# Altium project PADS_PCB.PrjPcb
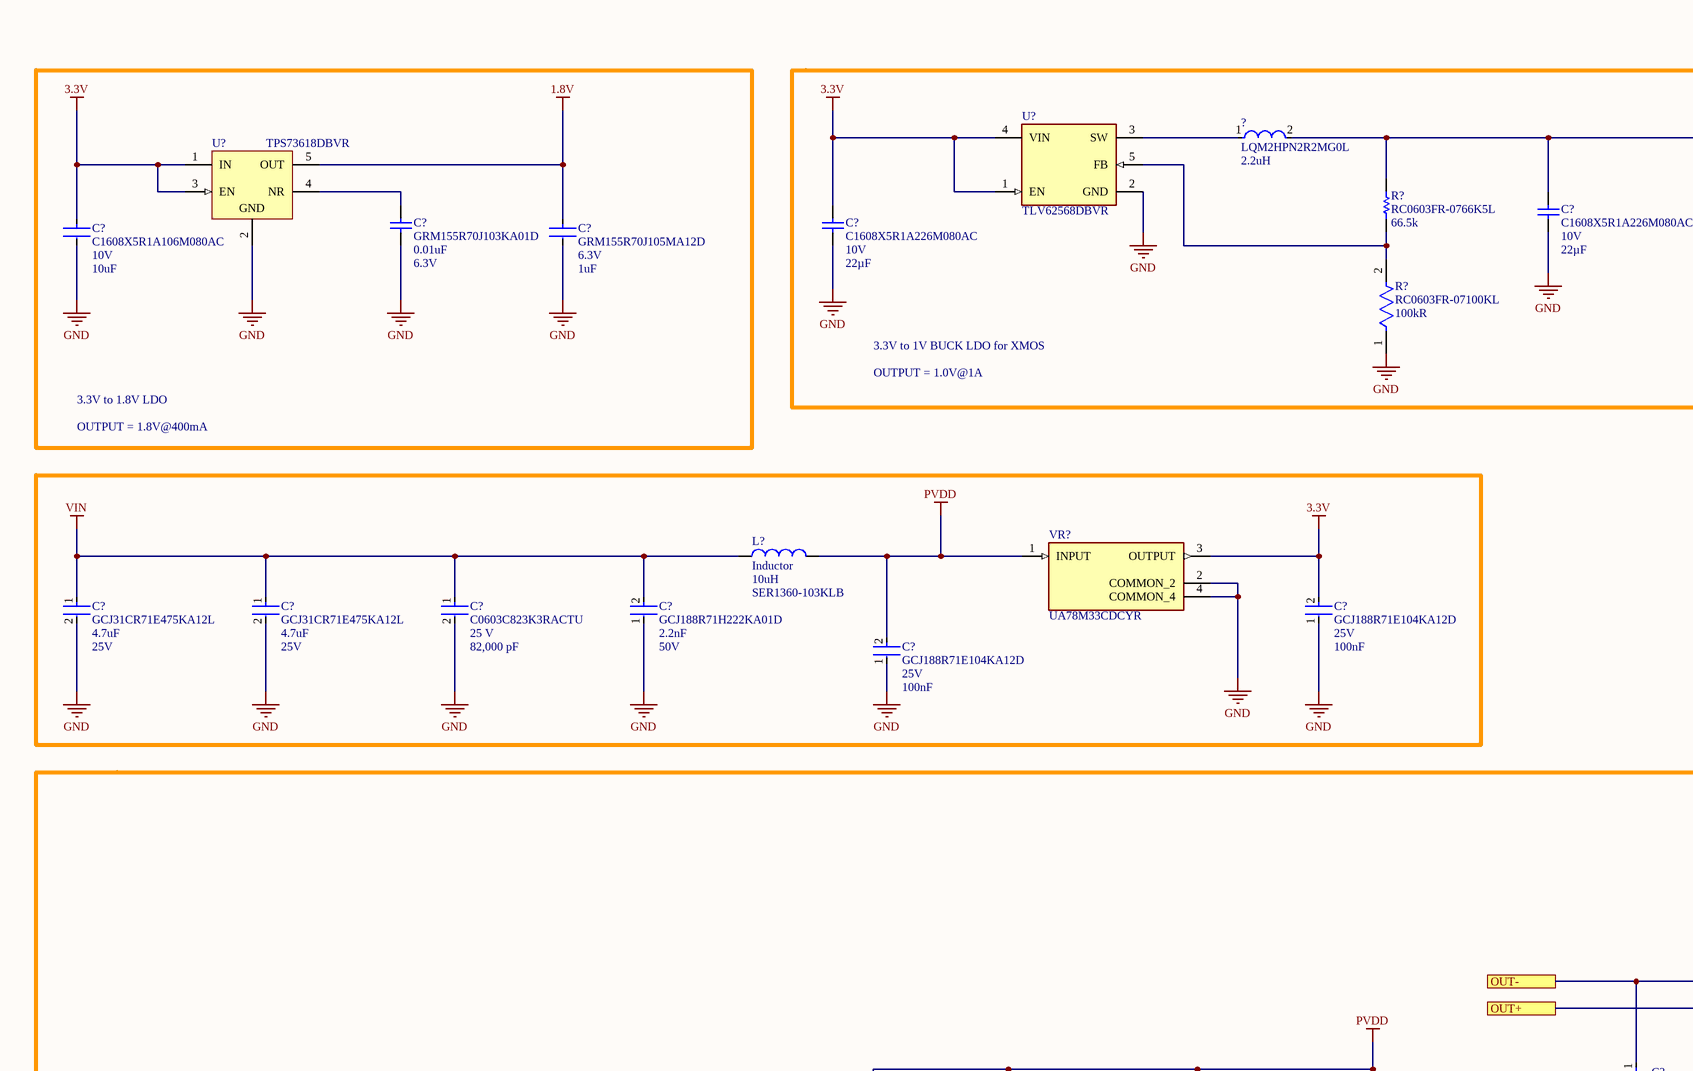
[diagram p0: Sheet1.SchDoc, top left]
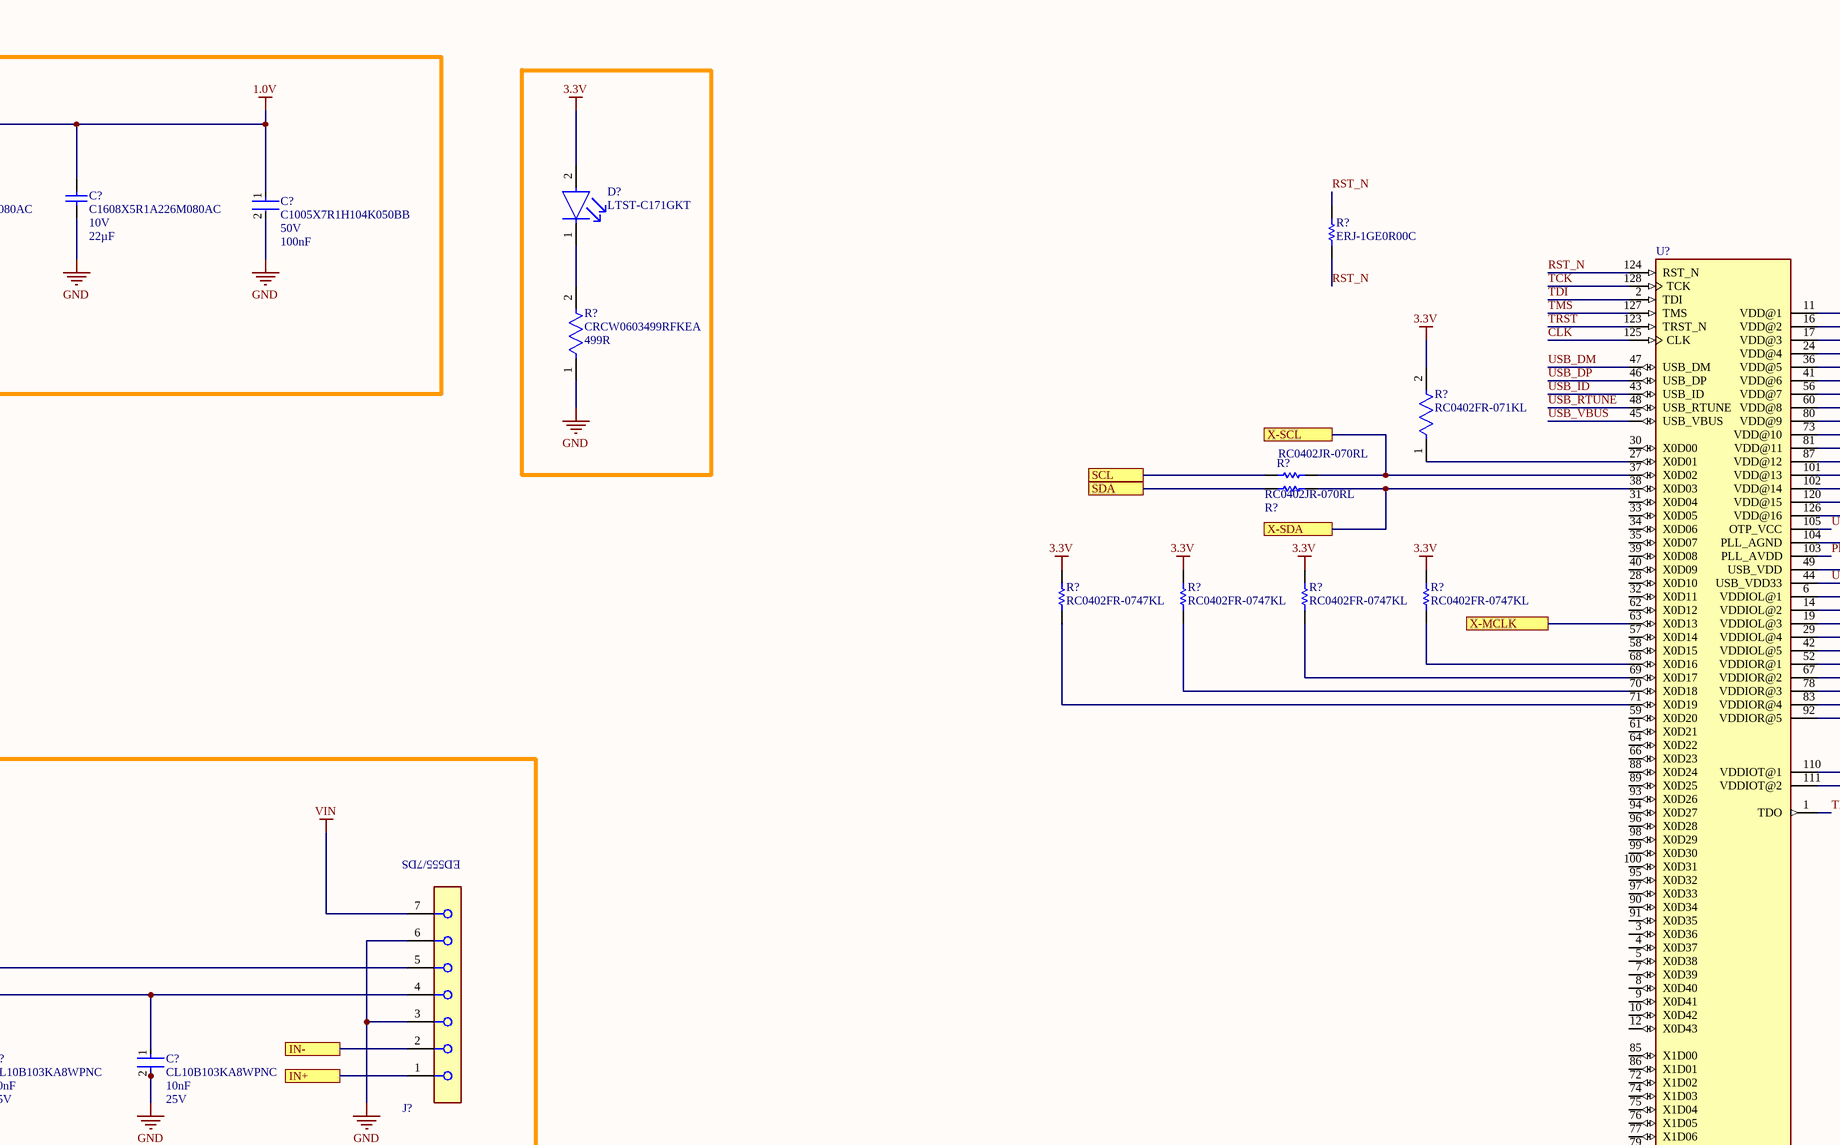
[diagram p1: Sheet1.SchDoc, top middle]
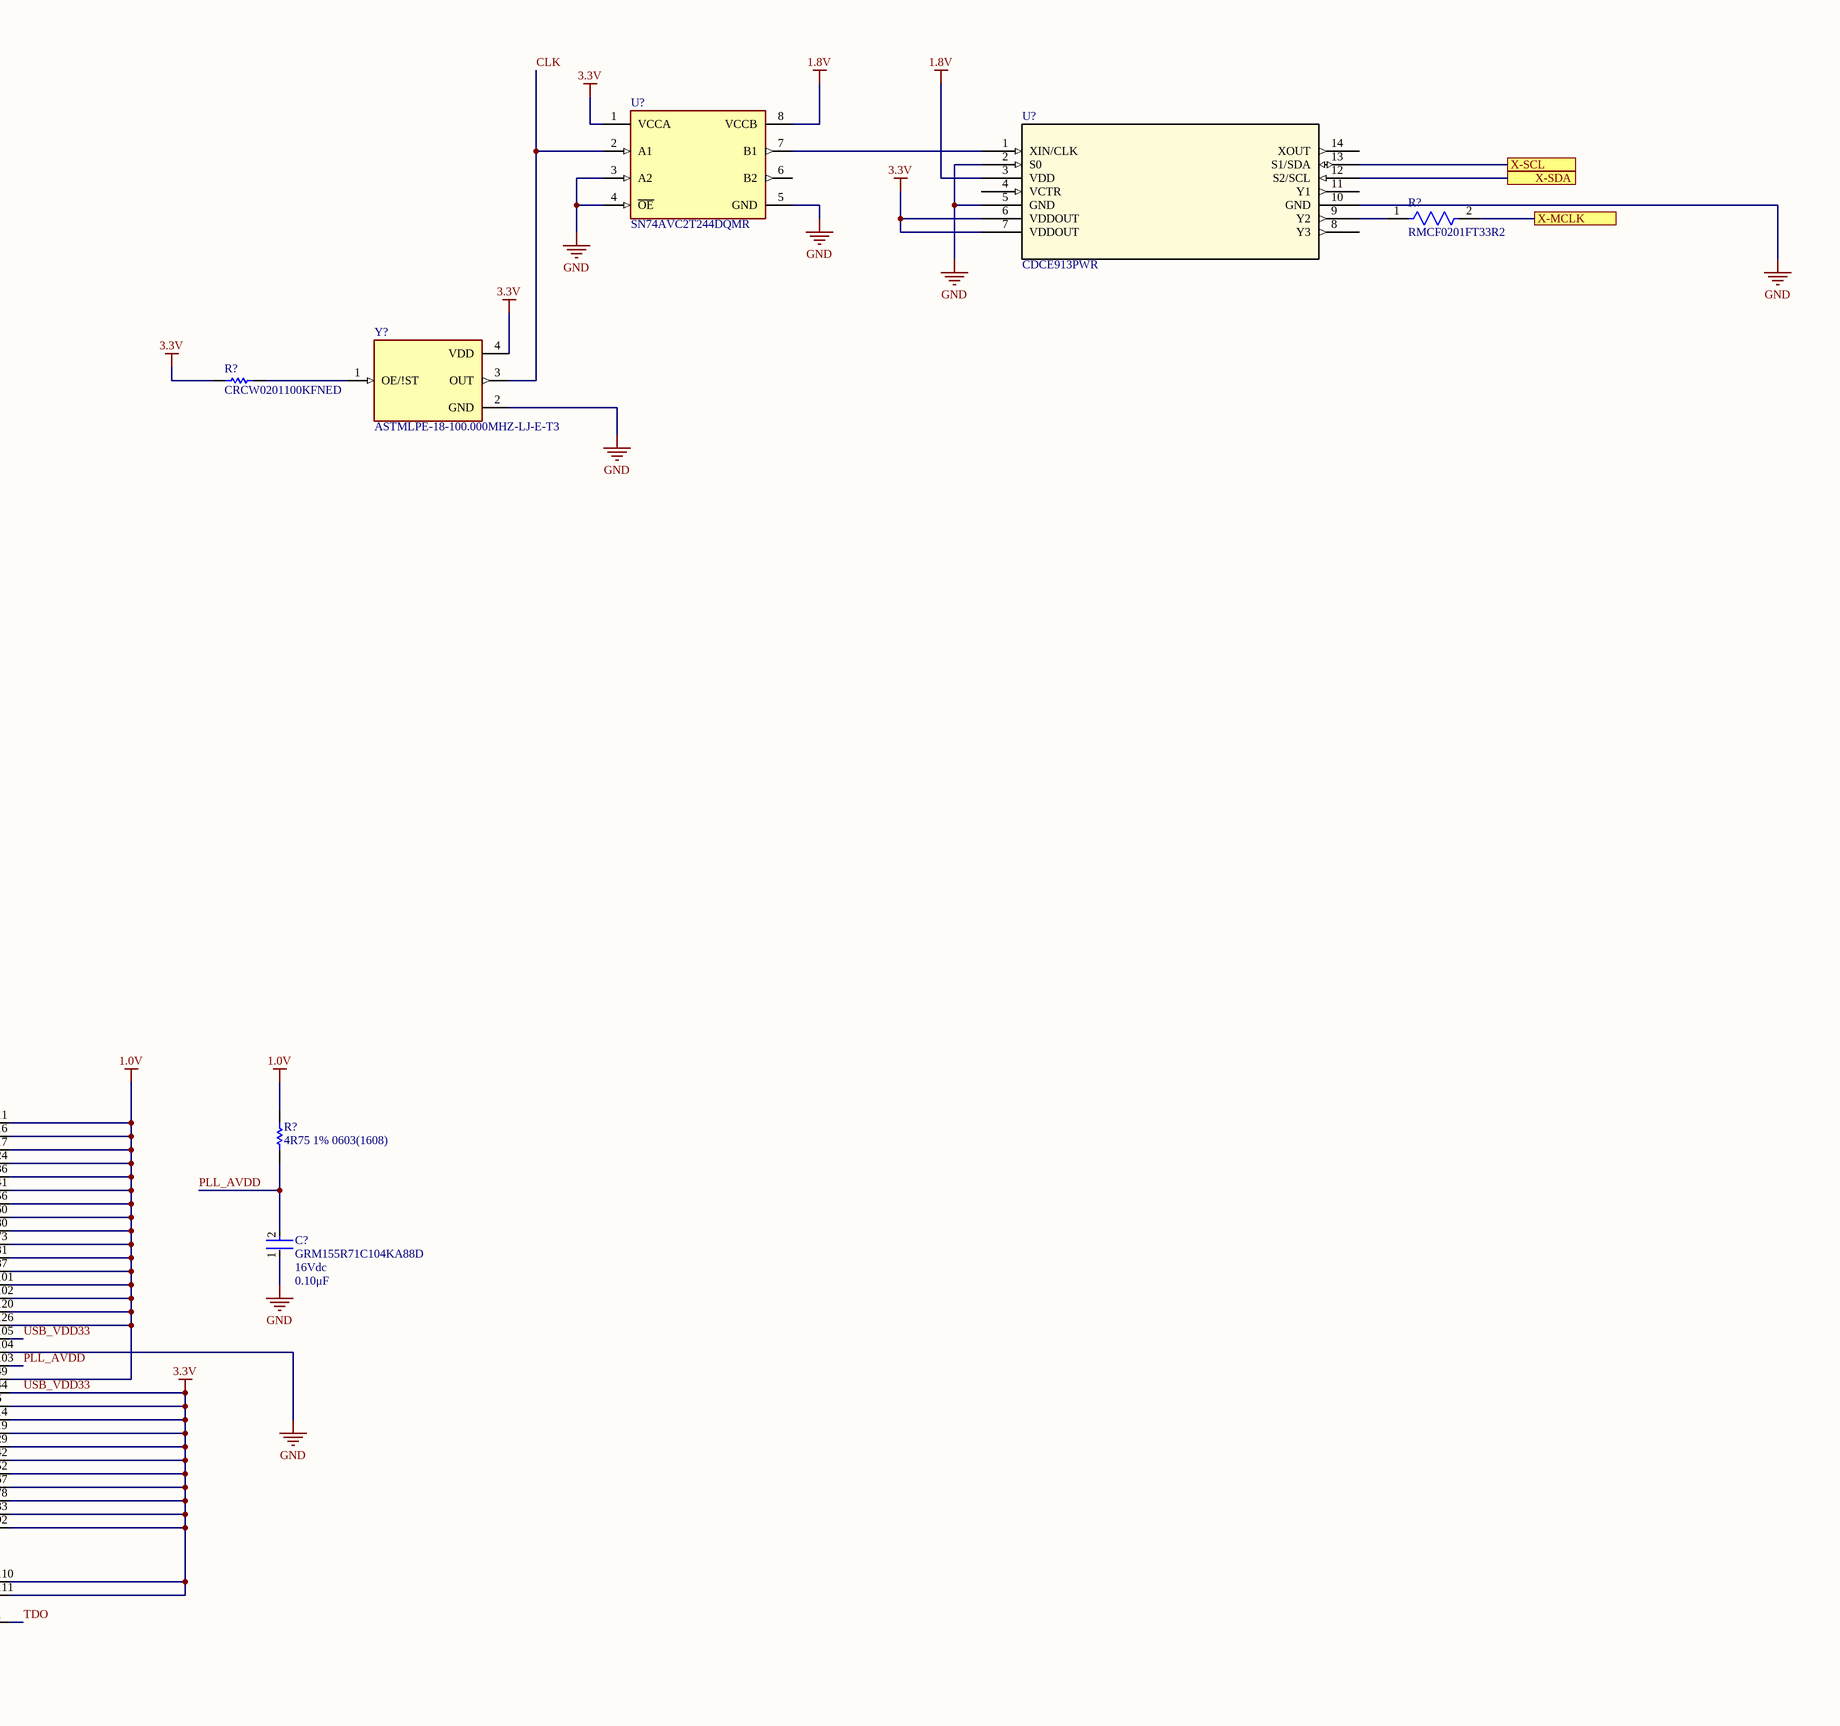
[diagram p2: Sheet1.SchDoc, top right]
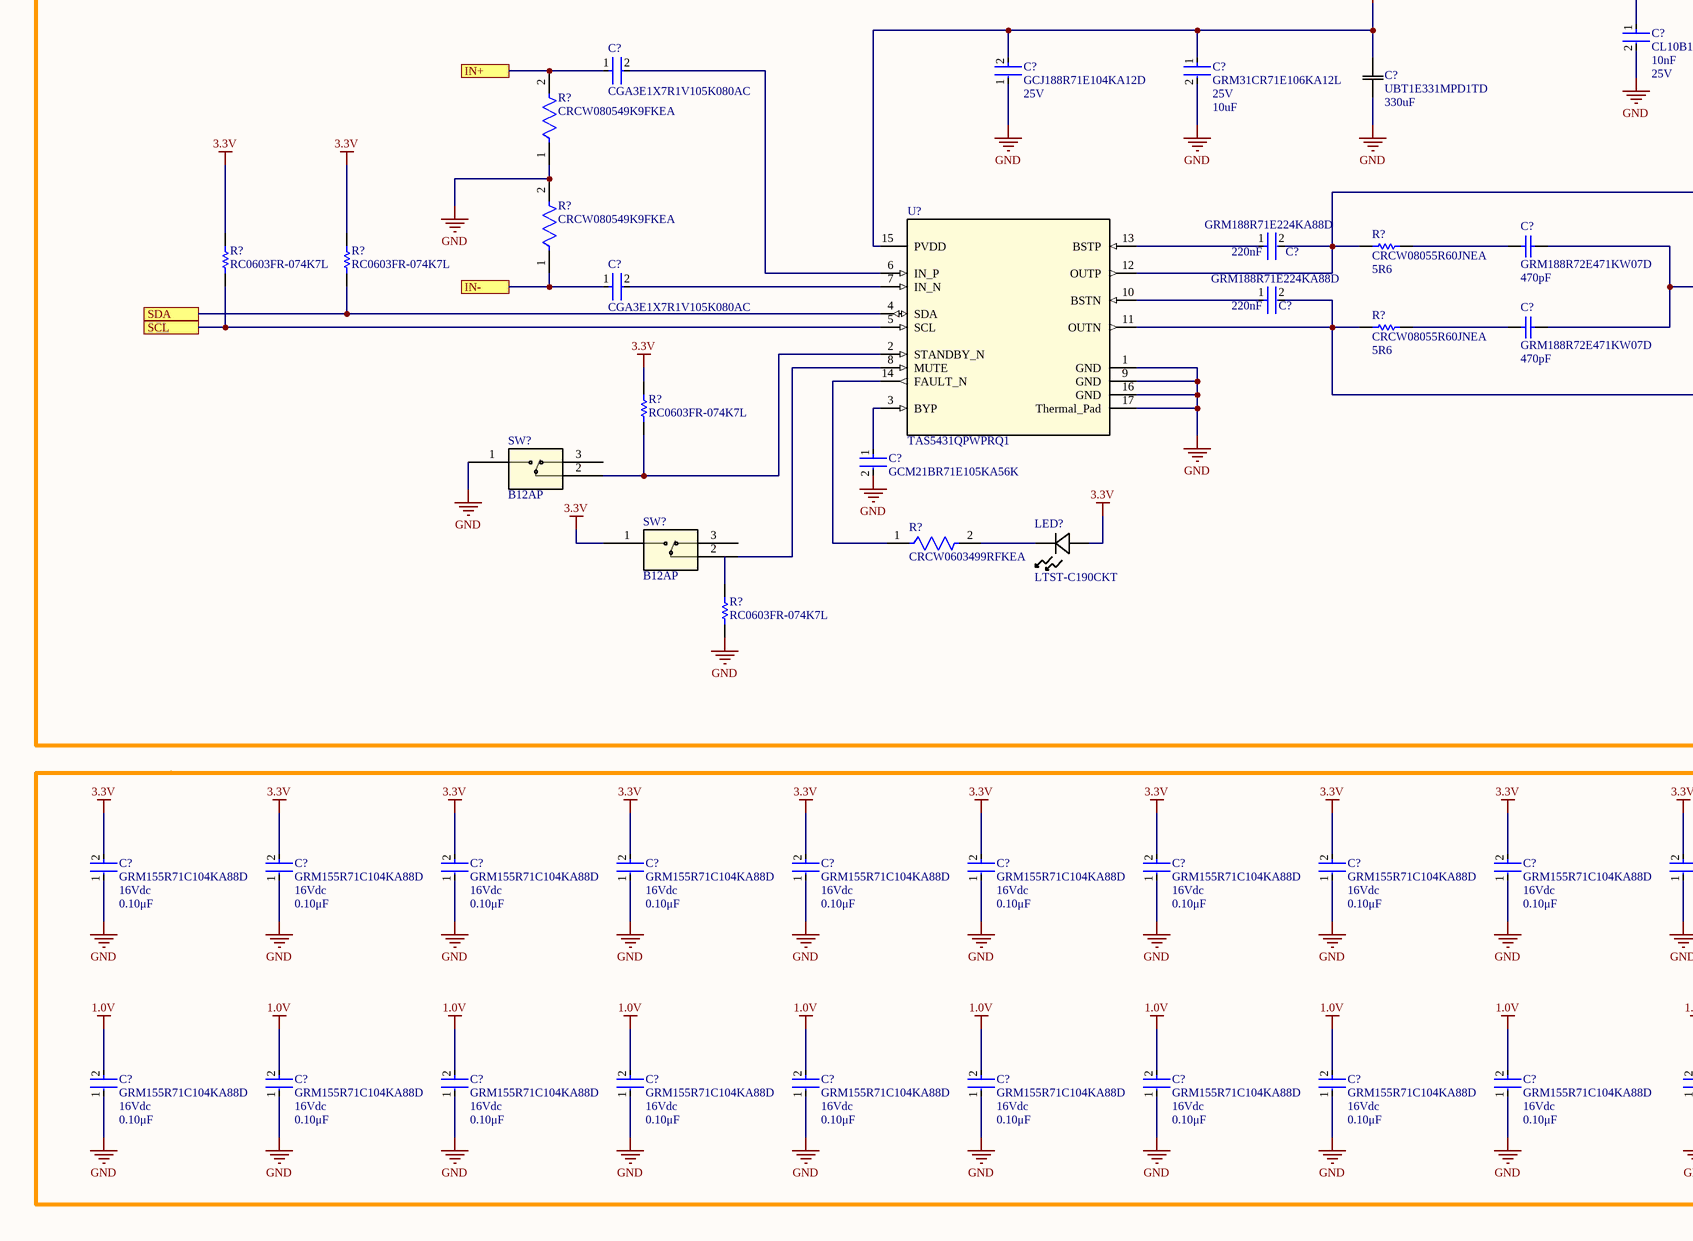
[diagram p3: Sheet1.SchDoc, bottom left]
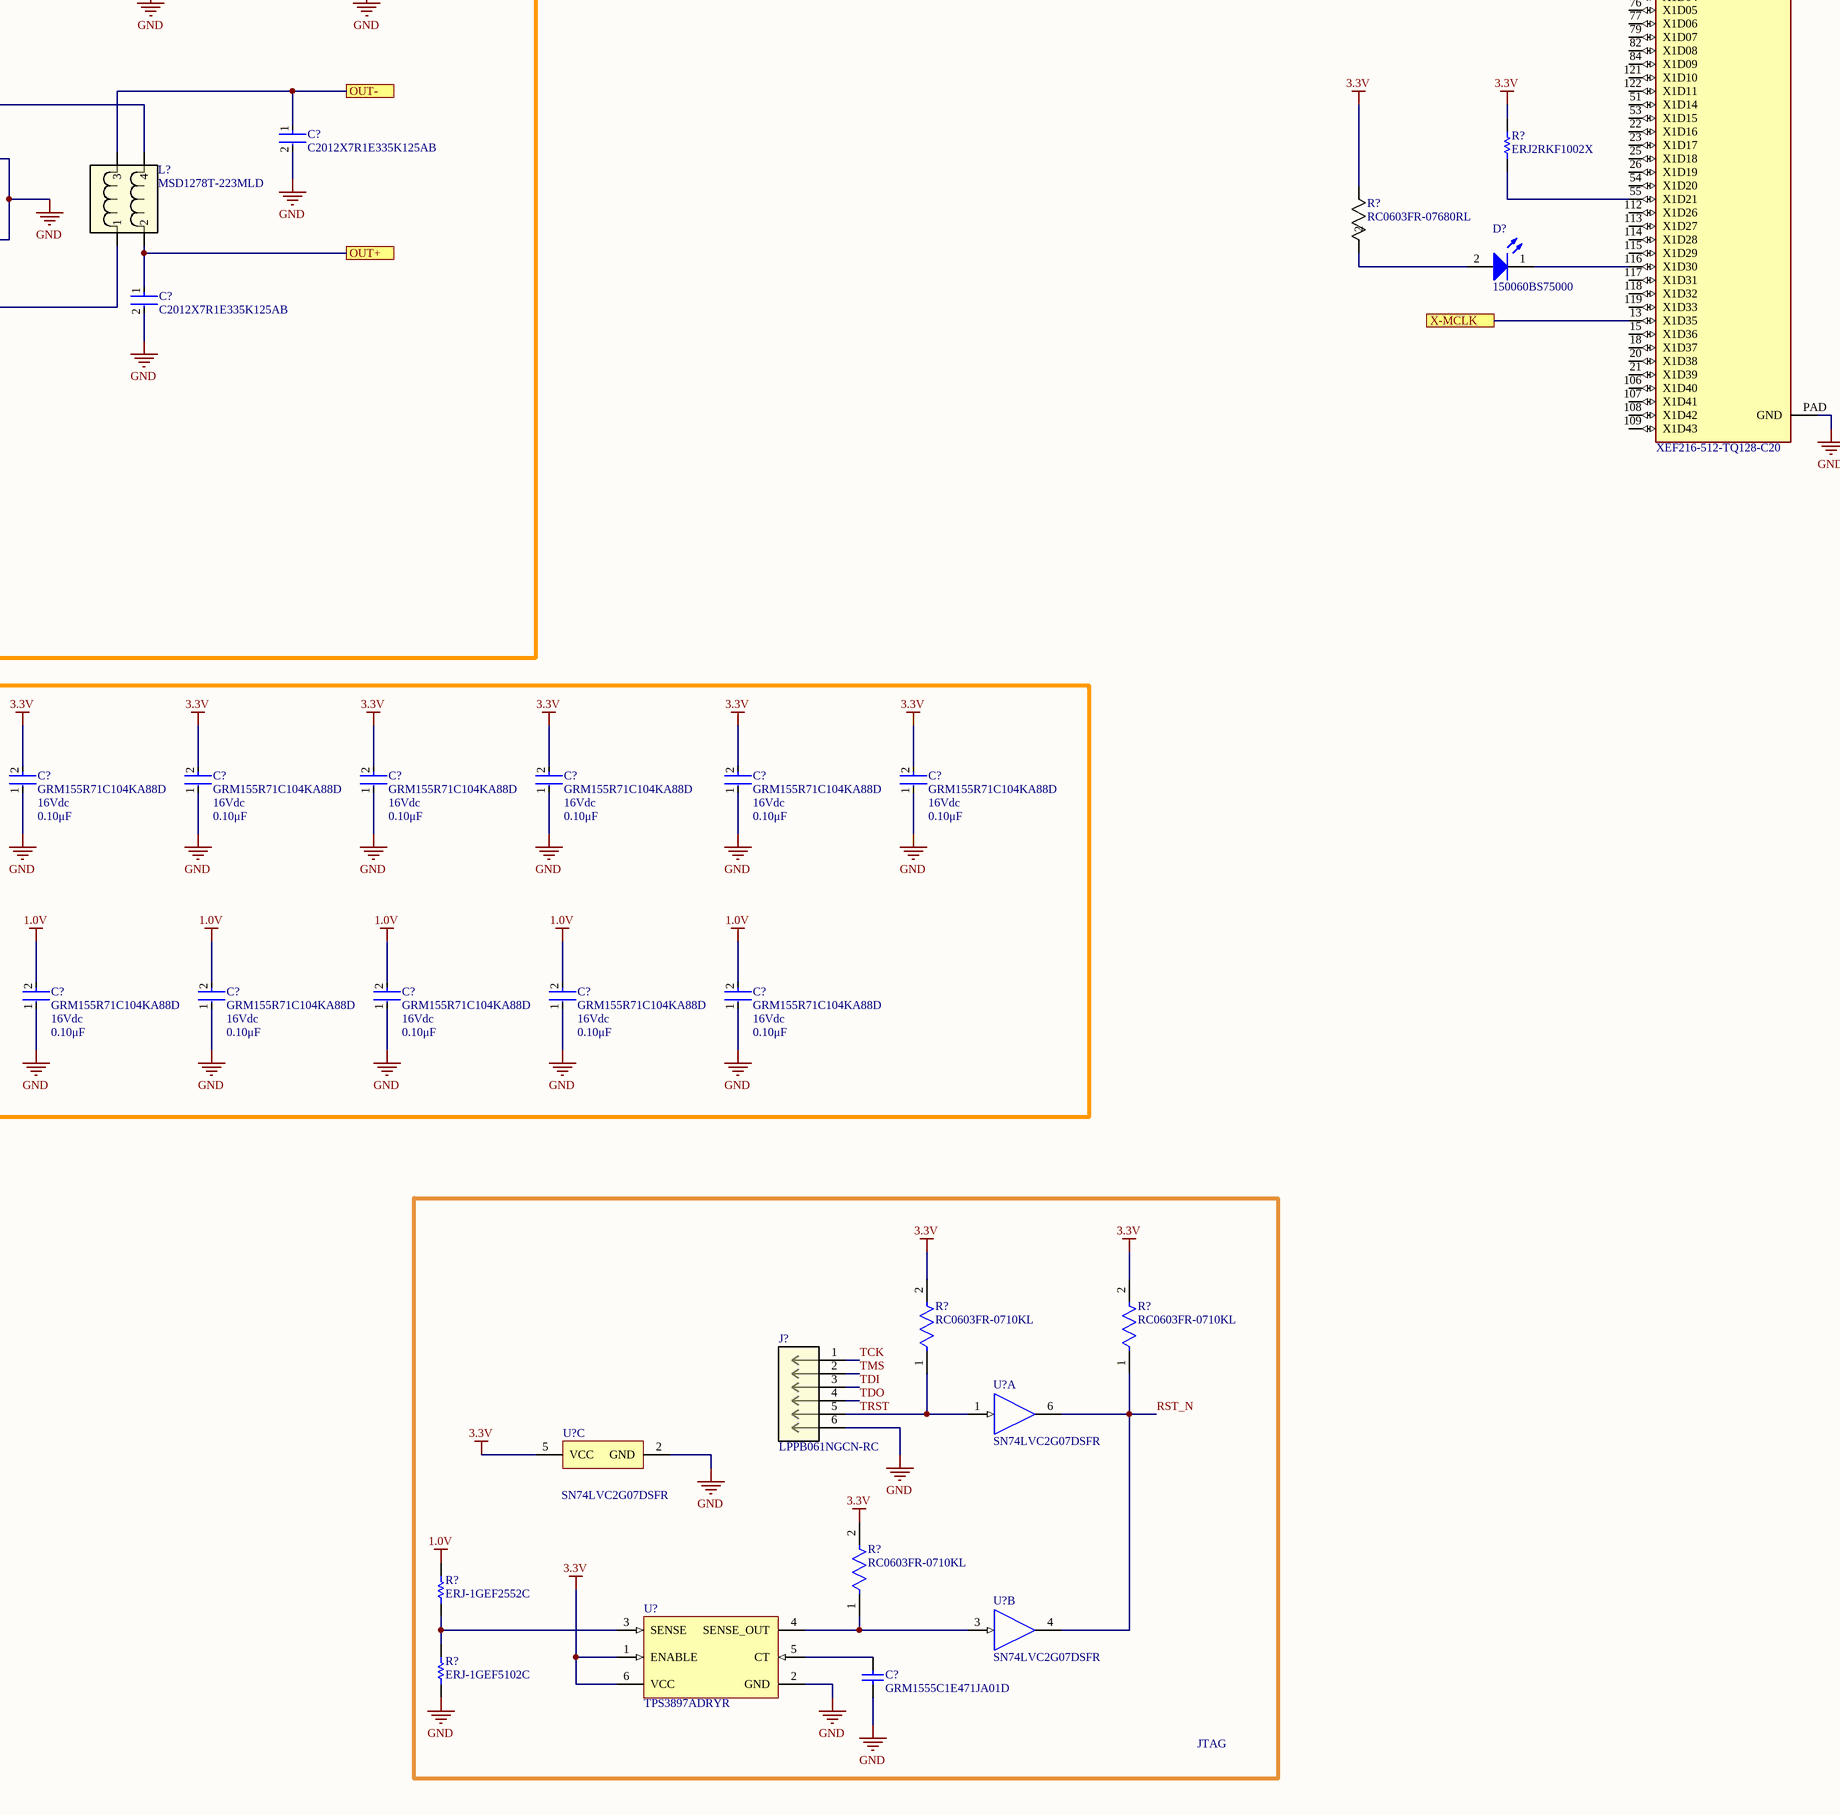
[diagram p4: Sheet1.SchDoc, bottom middle]
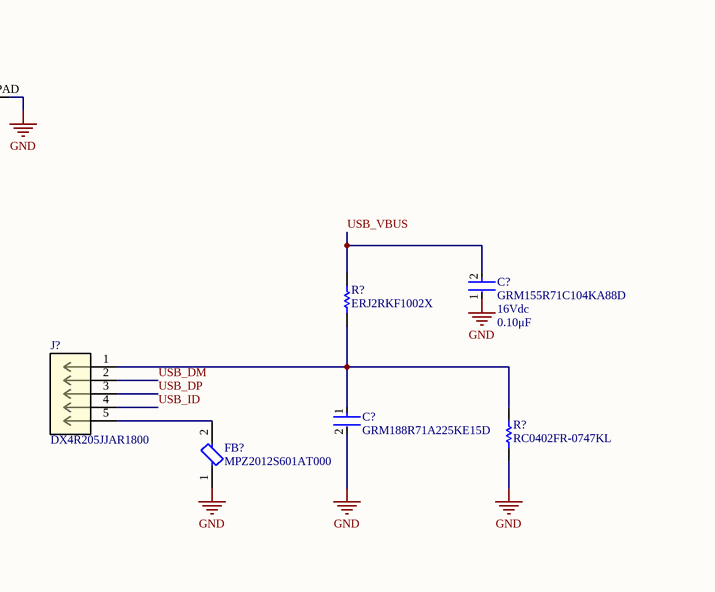
[diagram p5: Sheet1.SchDoc, bottom right]
1 sheet, 116 parts. Net scope: flat (ports and power ports of the same name join across sheets).

## Sheet Sheet1.SchDoc
size A0; SheetNumber: 1; SheetTotal: 1

### Parts
(Parts that share a designator on the sheet are numbered #1, #2 ... from top to bottom, then left to right.)
?  LQM2HPN2R2MG0L  Inductance: 2.2uH  [FP-LQM2HPN_G0-IPC_C]
C?#1  C1005X7R1H104K050BB  Voltage Rating (DC): 50V  Capacitance: 100nF  [FP-C1005-050-0_05-IPC_C]
C?#2  C1608X5R1A106M080AC  Voltage Rating: 10V  Capacitance: 10uF  [FP-C1608-080-0_1-IPC_A]
C?#3  GRM155R70J105MA12D  Voltage Rating: 6.3V  Capacitance: 1uF  [FP-GRM155-0_05-IPC_A]
C?#4  GRM155R70J103KA01D  C: 0.01uF  V: 6.3V  [CAPC1005X55X25ML05T10]
C?#5  C1608X5R1A226M080AC  Voltage - Rated: 10V  Capacitance: 22µF  [CAPC1608X100X20ML10]
C?#6  C1608X5R1A226M080AC  Voltage - Rated: 10V  Capacitance: 22µF  [CAPC1608X100X20ML10]
C?#7  C1608X5R1A226M080AC  Voltage - Rated: 10V  Capacitance: 22µF  [CAPC1608X100X20ML10]
C?#8  GRM155R71C104KA88D  value 0.10μF  Voltage Rating: 16Vdc  [FP-GRM15-MFG]
C?#9  GCJ31CR71E475KA12L  Capacitance: 4.7uF  Voltage Rating (DC): 25V  [FP-GCJ31C-0_3-IPC_A]
C?#10  GCJ31CR71E475KA12L  Capacitance: 4.7uF  Voltage Rating: 25V  [FP-GCJ31C-0_3-IPC_A]
C?#11  C0603C823K3RACTU  Voltage Rating: 25 V  Capacitance: 82,000 pF  [FP-C0603C-CF-MFG]
C?#12  GCJ188R71H222KA01D  Capacitance: 2.2nF  Voltage Rating: 50V  [FP-GCJ188-0_2-IPC_A]
C?#13  GCJ188R71E104KA12D  Voltage Rating: 25V  Capacitance: 100nF  [FP-GCJ188-0_2-MFG]
C?#14  GCJ188R71E104KA12D  Voltage Rating: 25V  Capacitance: 100nF  [FP-GCJ188-0_2-MFG]
C?#15  CL10B103KA8WPNC  Capacitance: 10nF  Voltage Rating: 25V  [FP-CL10-IPC_A]
C?#16  CL10B103KA8WPNC  Capacitance: 10nF  Voltage Rating: 25V  [FP-CL10-IPC_A]
C?#17  GCJ188R71E104KA12D  Voltage Rating: 25V  [FP-GCJ188-0_2-IPC_C]
C?#18  GRM31CR71E106KA12L  Voltage: 25V  Capacitance: 10uF  [FP-GRM31C-0_2-e0_3_0_8-MFG]
C?#19  CGA3E1X7R1V105K080AC  [FP-CGA3E-0_3-0_1-IPC_B]
C?#20  UBT1E331MPD1TD  C: 330uF  [U1-S_NCH]
C?#21  C2012X7R1E335K125AB  [FP-C2012-125-0_2-MFG]
C?#22  GRM188R72E471KW07D  C: 470pF  [CAPC1608X90X35LL10T15]
C?#23  GRM188R71E224KA88D  Capacitance: 220nF  [FP-GRM188-0_1-e0_2_0_5-IPC_C]
C?#24  CGA3E1X7R1V105K080AC  [FP-CGA3E-0_3-0_1-IPC_B]
C?#25  GRM188R71E224KA88D  Capacitance: 220nF  [FP-GRM188-0_1-e0_2_0_5-IPC_C]
C?#26  GRM188R72E471KW07D  C: 470pF  [CAPC1608X90X35LL10T15]
C?#27  C2012X7R1E335K125AB  [FP-C2012-125-0_2-MFG]
C?#28  GCM21BR71E105KA56K  [FP-GCM21B-0_15-MFG]
C?#29  GRM155R71C104KA88D  value 0.10μF  Voltage Rating: 16Vdc  [FP-GRM15-MFG]
C?#30  GRM188R71A225KE15D  [FP-GRM188-0_1-e0_2_0_5-MFG]
C?#31  GRM155R71C104KA88D  value 0.10μF  Voltage Rating: 16Vdc  [FP-GRM15-MFG]
C?#32  GRM155R71C104KA88D  value 0.10μF  Voltage Rating: 16Vdc  [FP-GRM15-MFG]
C?#33  GRM155R71C104KA88D  value 0.10μF  Voltage Rating: 16Vdc  [FP-GRM15-MFG]
C?#34  GRM155R71C104KA88D  value 0.10μF  Voltage Rating: 16Vdc  [FP-GRM15-MFG]
C?#35  GRM155R71C104KA88D  value 0.10μF  Voltage Rating: 16Vdc  [FP-GRM15-MFG]
C?#36  GRM155R71C104KA88D  value 0.10μF  Voltage Rating: 16Vdc  [FP-GRM15-MFG]
C?#37  GRM155R71C104KA88D  value 0.10μF  Voltage Rating: 16Vdc  [FP-GRM15-MFG]
C?#38  GRM155R71C104KA88D  value 0.10μF  Voltage Rating: 16Vdc  [FP-GRM15-MFG]
C?#39  GRM155R71C104KA88D  value 0.10μF  Voltage Rating: 16Vdc  [FP-GRM15-MFG]
C?#40  GRM155R71C104KA88D  value 0.10μF  Voltage Rating: 16Vdc  [FP-GRM15-MFG]
C?#41  GRM155R71C104KA88D  value 0.10μF  Voltage Rating: 16Vdc  [FP-GRM15-MFG]
C?#42  GRM155R71C104KA88D  value 0.10μF  Voltage Rating: 16Vdc  [FP-GRM15-MFG]
C?#43  GRM155R71C104KA88D  value 0.10μF  Voltage Rating: 16Vdc  [FP-GRM15-MFG]
C?#44  GRM155R71C104KA88D  value 0.10μF  Voltage Rating: 16Vdc  [FP-GRM15-MFG]
C?#45  GRM155R71C104KA88D  value 0.10μF  Voltage Rating: 16Vdc  [FP-GRM15-MFG]
C?#46  GRM155R71C104KA88D  value 0.10μF  Voltage Rating: 16Vdc  [FP-GRM15-MFG]
C?#47  GRM155R71C104KA88D  value 0.10μF  Voltage Rating: 16Vdc  [FP-GRM15-MFG]
C?#48  GRM155R71C104KA88D  value 0.10μF  Voltage Rating: 16Vdc  [FP-GRM15-MFG]
C?#49  GRM155R71C104KA88D  value 0.10μF  Voltage Rating: 16Vdc  [FP-GRM15-MFG]
C?#50  GRM155R71C104KA88D  value 0.10μF  Voltage Rating: 16Vdc  [FP-GRM15-MFG]
C?#51  GRM155R71C104KA88D  value 0.10μF  Voltage Rating: 16Vdc  [FP-GRM15-MFG]
C?#52  GRM155R71C104KA88D  value 0.10μF  Voltage Rating: 16Vdc  [FP-GRM15-MFG]
C?#53  GRM155R71C104KA88D  value 0.10μF  Voltage Rating: 16Vdc  [FP-GRM15-MFG]
C?#54  GRM155R71C104KA88D  value 0.10μF  Voltage Rating: 16Vdc  [FP-GRM15-MFG]
C?#55  GRM155R71C104KA88D  value 0.10μF  Voltage Rating: 16Vdc  [FP-GRM15-MFG]
C?#56  GRM155R71C104KA88D  value 0.10μF  Voltage Rating: 16Vdc  [FP-GRM15-MFG]
C?#57  GRM155R71C104KA88D  value 0.10μF  Voltage Rating: 16Vdc  [FP-GRM15-MFG]
C?#58  GRM155R71C104KA88D  value 0.10μF  Voltage Rating: 16Vdc  [FP-GRM15-MFG]
C?#59  GRM155R71C104KA88D  value 0.10μF  Voltage Rating: 16Vdc  [FP-GRM15-MFG]
C?#60  GRM1555C1E471JA01D  [CAPC1005X55X25LL05T10]
D?#1  LTST-C171GKT  [FP-LTST-C171GKT-MFG]
D?#2  150060BS75000  [WL-SMCW_0603_150060xx75000]
FB?  MPZ2012S601AT000  [FP-MPZ2012-IPC_A]
J?#1  ED555-7DS  [On_Shore_Technology_Inc._ED555-7DS_0]  (value not drawn)
J?#2  DX4R205JJAR1800  [CONN_DX4R205JJAR1800_JAE]
J?#3  LPPB061NGCN-RC  [CONN_LPPB061NGCN-RC_SUL]
L?#1  Inductor  value 10uH  Model name: SER1360-103KLB  [SER1360 SERIES]
L?#2  MSD1278T-223MLD  [SMD4_MSD1278T_COC]
LED?  LTST-C190CKT  [LED_LTST-C190CKT_LTO]
R?#1  RMCF0201FT33R2  [FP-RMCF0201-IPC_C]
R?#2  CRCW0201100KFNED  [RESC0603X28X15LL05T05]
R?#3  RC0603FR-0766K5L  Resistance: 66.5k  [RESC1608X55X25ML10T15]
R?#4  ERJ-1GE0R00C  [RESC0603X26X15LL03T05]
R?#5  RC0603FR-07100KL  Resistance: 100kR  [FP-RC0603-0_55-MFG]
R?#6  4R75 1% 0603(1608)  [RESC0603(1608)_L]
R?#7  CRCW0603499RFKEA  Resistance: 499R  [FP-CRCW0603-e3-MFG]
R?#8  RC0402JR-070RL  [RESC1005X40X25NL05T10]
R?#9  RC0402FR-071KL  [FP-RC0402-0_4-IPC_A]
R?#10  RC0402JR-070RL  [RESC1005X40X25NL05T10]
R?#11  RC0402FR-0747KL  [RESC1005X40X25ML05T10]
R?#12  RC0402FR-0747KL  [RESC1005X40X25ML05T10]
R?#13  RC0402FR-0747KL  [RESC1005X40X25ML05T10]
R?#14  RC0402FR-0747KL  [RESC1005X40X25ML05T10]
R?#15  CRCW080549K9FKEA  [FP-CRCW0805-e3-IPC_C]
R?#16  ERJ2RKF1002X  [RESC1005X40X25LL05T05]
R?#17  CRCW08055R60JNEA  R: 5R6  [RESC2013X50X30ML20T20]
R?#18  RC0603FR-074K7L  [RESC1608X55X25LL10T15]
R?#19  RC0603FR-074K7L  [RESC1608X55X25LL10T15]
R?#20  CRCW080549K9FKEA  [FP-CRCW0805-e3-IPC_C]
R?#21  CRCW08055R60JNEA  R: 5R6  [RESC2013X50X30ML20T20]
R?#22  RC0603FR-07680RL  [RC0603N_YAG]
R?#23  RC0603FR-074K7L  [RESC1608X55X25LL10T15]
R?#24  CRCW0603499RFKEA  [FP-CRCW0603-e3-IPC_A]
R?#25  RC0603FR-074K7L  [RESC1608X55X25LL10T15]
R?#26  ERJ2RKF1002X  [RESC1005X40X25LL05T05]
R?#27  RC0402FR-0747KL  [RESC1005X40X25ML05T10]
R?#28  RC0603FR-0710KL  [FP-RC0603-0_55-IPC_C]
R?#29  RC0603FR-0710KL  [FP-RC0603-0_55-IPC_C]
R?#30  ERJ-1GEF2552C  [RESC0603X26X15LL03T05]
R?#31  RC0603FR-0710KL  [FP-RC0603-0_55-IPC_C]
R?#32  ERJ-1GEF5102C  [RESC0603X26X15LL03T05]
SW?#1  B12AP  [B12AP_NKK]
SW?#2  B12AP  [B12AP_NKK]
U?#1  SN74AVC2T244DQMR  [FP-DQM0008A-MFG]
U?#2  CDCE913PWR  [PW14]
U?#3  TLV62568DBVR  [FP-DBV0005A-MFG]
U?#4  TPS73618DBVR  [DBV0005A_L]
U?#5  XEF216-512-TQ128-C20  [QFP40P1600X1600X120-129N]
U?#6  TAS5431QPWPRQ1  [PWP0016B-IPC_A]
U?#7  SN74LVC2G07DSFR  [DSF0006A_V]  (part A of 3)
U?#8  SN74LVC2G07DSFR  [DSF0006A_V]  (part C of 3)
U?#9  SN74LVC2G07DSFR  [DSF0006A_V]  (part B of 3)
U?#10  TPS3897ADRYR  [DRY0006A]
VR?  UA78M33CDCYR  [VREG_UA78M33CDCYR]
Y?  ASTMLPE-18-100.000MHZ-LJ-E-T3  [OSCDFN320X250X80-4N]

### Blocks framed on the sheet
JTAG: C?#60 J?#3 R?#28-R?#32 U?#7-U?#10

### Ports
IN+, IN-, OUT+, OUT-, SCL, SDA, X-MCLK, X-SCL, X-SDA

### Nets
1.0V: ?.2 C?#1.1 C?#5.2 C?#6.2 C?#46.2 C?#47.2 C?#48.2 C?#49.2 C?#50.2 C?#51.2 C?#52.2 C?#53.2 C?#54.2 C?#55.2 C?#56.2 C?#57.2 C?#58.2 C?#59.2 R?#3.2 R?#6.2 R?#30.2 U?#5.11(VDD@1) U?#5.16(VDD@2) U?#5.17(VDD@3) U?#5.24(VDD@4) U?#5.36(VDD@5) U?#5.41(VDD@6) U?#5.49(USB_VDD) U?#5.56(VDD@7) U?#5.60(VDD@8) U?#5.73(VDD@10) U?#5.80(VDD@9) U?#5.81(VDD@11) U?#5.87(VDD@12) U?#5.101(VDD@13) U?#5.102(VDD@14) U?#5.120(VDD@15) U?#5.126(VDD@16)
1.8V: C?#3.1 U?#1.8(VCCB) U?#2.3(VDD) U?#4.5(OUT)
GND: C?#1.2 C?#2.1 C?#3.2 C?#4.1 C?#5.1 C?#6.1 C?#7.1 C?#8.1 C?#9.2 C?#10.2 C?#11.2 C?#12.1 C?#13.1 C?#14.1 C?#15.2 C?#16.2 C?#17.1 C?#18.2 C?#20.1 C?#21.2 C?#22.2 C?#26.2 C?#27.2 C?#28.2 C?#29.1 C?#30.2 C?#31.1 C?#32.1 C?#33.1 C?#34.1 C?#35.1 C?#36.1 C?#37.1 C?#38.1 C?#39.1 C?#40.1 C?#41.1 C?#42.1 C?#43.1 C?#44.1 C?#45.1 C?#46.1 C?#47.1 C?#48.1 C?#49.1 C?#50.1 C?#51.1 C?#52.1 C?#53.1 C?#54.1 C?#55.1 C?#56.1 C?#57.1 C?#58.1 C?#59.1 C?#60.1 FB?.1 J?#1.3 J?#1.6 J?#3.6 R?#5.1 R?#7.1 R?#15.1 R?#20.2 R?#25.1 R?#27.1 R?#32.1 SW?#1.1 U?#1.3(A2) U?#1.4(~{OE}) U?#1.5(GND) U?#2.2(S0) U?#2.5(GND) U?#2.10(GND) U?#3.2(GND) U?#4.2(GND) U?#5.104(PLL_AGND) U?#5.PAD(GND) U?#6.1(GND) U?#6.9(GND) U?#6.16(GND) U?#6.17(Thermal_Pad) U?#8.2(GND) U?#10.2(GND) VR?.2(COMMON_2) VR?.4(COMMON_4) Y?.2(GND)
PVDD: C?#14.2 C?#17.2 C?#18.1 C?#20.2 L?#1.2 U?#6.15(PVDD) VR?.1(INPUT)
USB_VDD33: C?#2.2 C?#7.2 C?#13.2 C?#31.2 C?#32.2 C?#33.2 C?#34.2 C?#35.2 C?#36.2 C?#37.2 C?#38.2 C?#39.2 C?#40.2 C?#41.2 C?#42.2 C?#43.2 C?#44.2 C?#45.2 D?#1.2(A) LED?.2 R?#2.1 R?#9.2 R?#11.2 R?#12.2 R?#13.2 R?#14.2 R?#16.2 R?#18.2 R?#19.2 R?#22.1 R?#23.2 R?#28.2 R?#29.2 R?#31.2 SW?#2.1 U?#1.1(VCCA) U?#2.6(VDDOUT) U?#2.7(VDDOUT) U?#3.1(EN) U?#3.4(VIN) U?#4.1(IN) U?#4.3(EN) U?#5.6(VDDIOL@1) U?#5.14(VDDIOL@2) U?#5.19(VDDIOL@3) U?#5.29(VDDIOL@4) U?#5.42(VDDIOL@5) U?#5.44(USB_VDD33) U?#5.52(VDDIOR@1) U?#5.67(VDDIOR@2) U?#5.78(VDDIOR@3) U?#5.83(VDDIOR@4) U?#5.92(VDDIOR@5) U?#5.105(OTP_VCC) U?#5.110(VDDIOT@1) U?#5.111(VDDIOT@2) U?#8.5(VCC) U?#10.1(ENABLE) U?#10.6(VCC) VR?.3(OUTPUT) Y?.4(VDD)  [also labelled 3.3V]
VIN: C?#9.1 C?#10.1 C?#11.1 C?#12.2 J?#1.7 L?#1.1
CLK: U?#1.2(A1) U?#5.125(CLK) Y?.3(OUT)
PLL_AVDD: C?#8.2 R?#6.1 U?#5.103(PLL_AVDD)
RST_N: R?#4.1 R?#4.2 R?#29.1 U?#5.124(RST_N) U?#7.6(1Y) U?#9.4(2Y)
TCK: J?#3.1 U?#5.128(TCK)
TDI: J?#3.3 U?#5.2(TDI)
TDO: J?#3.4 U?#5.1(TDO)
TMS: J?#3.2 U?#5.127(TMS)
TRST: J?#3.5 R?#28.1 U?#5.123(TRST_N) U?#7.1(1A)
USB_DM: J?#2.2 U?#5.47(USB_DM)
USB_DP: J?#2.3 U?#5.46(USB_DP)
USB_ID: J?#2.4 U?#5.43(USB_ID)
USB_RTUNE: U?#5.48(USB_RTUNE)
USB_VBUS: C?#29.2 R?#26.2 U?#5.45(USB_VBUS)
Net?_1: ?.1 U?#3.3(SW)
NetC?#4_2: C?#4.2 U?#4.4(NR)
NetC?#15_1: C?#15.1 C?#21.1 J?#1.5 L?#2.3 ; port OUT-
NetC?#16_1: C?#16.1 C?#27.1 J?#1.4 L?#2.2 ; port OUT+
NetC?#19_1: C?#19.1 J?#1.1 R?#15.2 ; port IN+
NetC?#19_2: C?#19.2 U?#6.6(IN_P)
NetC?#22_1: C?#22.1 R?#17.1
NetC?#23_1: C?#23.1 U?#6.13(BSTP)
NetC?#23_2: C?#23.2 L?#2.4 R?#17.2 U?#6.12(OUTP)
NetC?#24_1: C?#24.1 J?#1.2 R?#20.1 ; port IN-
NetC?#24_2: C?#24.2 U?#6.7(IN_N)
NetC?#25_1: C?#25.1 U?#6.10(BSTN)
NetC?#25_2: C?#25.2 L?#2.1 R?#21.2 U?#6.11(OUTN)
NetC?#26_1: C?#26.1 R?#21.1
NetC?#28_1: C?#28.1 U?#6.3(BYP)
NetC?#30_1: C?#30.1 J?#2.1 R?#26.1 R?#27.2
NetC?#60_2: C?#60.2 U?#10.5(CT)
NetD?#1_1: D?#1.1(C) R?#7.2
NetD?#2_1: D?#2.1(K) U?#5.116(X1D30)
NetD?#2_2: D?#2.2(A) R?#22.2
NetFB?_2: FB?.2 J?#2.5
NetLED?_1: LED?.1 R?#24.2
NetR?#1_1: R?#1.1 U?#2.9(Y2)
NetR?#1_2: R?#1.2 U?#5.13(X1D35) U?#5.63(X0D13) ; port X-MCLK
NetR?#2_2: R?#2.2 Y?.1(OE/!ST)
NetR?#3_1: R?#3.1 R?#5.2 U?#3.5(FB)
NetR?#8_1: R?#8.1 R?#18.1 U?#6.5(SCL) ; port SCL
NetR?#8_2: R?#8.2 U?#2.13(S1/SDA) U?#5.37(X0D02) ; port X-SCL
NetR?#9_1: R?#9.1 U?#5.27(X0D01)
NetR?#10_1: R?#10.1 R?#19.1 U?#6.4(SDA) ; port SDA
NetR?#10_2: R?#10.2 U?#2.12(S2/SCL) U?#5.38(X0D03) ; port X-SDA
NetR?#11_1: R?#11.1 U?#5.71(X0D19)
NetR?#12_1: R?#12.1 U?#5.70(X0D18)
NetR?#13_1: R?#13.1 U?#5.69(X0D17)
NetR?#14_1: R?#14.1 U?#5.68(X0D16)
NetR?#16_1: R?#16.1 U?#5.55(X1D21)
NetR?#23_1: R?#23.1 SW?#1.2 U?#6.2(STANDBY_N)
NetR?#24_1: R?#24.1 U?#6.14(FAULT_N)
NetR?#30_1: R?#30.1 R?#32.2 U?#10.3(SENSE)
NetR?#31_1: R?#31.1 U?#9.3(2A) U?#10.4(SENSE_OUT)
NetSW?#2_2: SW?#2.2 U?#6.8(MUTE)
NetU?#1_7: U?#1.7(B1) U?#2.1(XIN/CLK)

Not connected (* = marked no-connect by the designer): R?#25 2; SW?#1 3; SW?#2 3; U?#1 6(B2); U?#2 4(VCTR) 8(Y3) 11(Y1) 14(XOUT); U?#5 3(X0D36) 4(X0D37) 5(X0D38) 7(X0D39) 8(X0D40) 9(X0D41) 10(X0D42) 12(X0D43) 15(X1D36) 18(X1D37) 20(X1D38) 21(X1D39) 22(X1D16) 23(X1D17) 25(X1D18) 26(X1D19) 28(X0D10) 30(X0D00) 31(X0D04) 32(X0D11) 33(X0D05) 34(X0D06) 35(X0D07) 39(X0D08) 40(X0D09) 51(X1D14) 53(X1D15) 54(X1D20) 57(X0D14) 58(X0D15) 59(X0D20) 61(X0D21) 62(X0D12) 64(X0D22) 66(X0D23) 72(X1D02) 74(X1D03) 75(X1D04) 76(X1D05) 77(X1D06) 79(X1D07) 82(X1D08) 84(X1D09) 85(X1D00) 86(X1D01) 88(X0D24) 89(X0D25) 90(X0D34) 91(X0D35) 93(X0D26) 94(X0D27) 95(X0D32) 96(X0D28) 97(X0D33) 98(X0D29) 99(X0D30) 100(X0D31) 106(X1D40) 107(X1D41) 108(X1D42) 109(X1D43) 112(X1D26) 113(X1D27) 114(X1D28) 115(X1D29) 117(X1D31) 118(X1D32) 119(X1D33) 121(X1D10) 122(X1D11)

### Notes on the sheet
- 3.3V to 1V BUCK LDO for XMOS
- 3.3V to 1.8V LDO
- OUTPUT = 1.8V@400mA
- OUTPUT = 1.0V@1A

### Library data of the parts
? = CMP-1662-00028-2: Multilayer Type Inductor for Power Lines, 1008 (2520), 2.2μH, 20%, 0.1Ω, 1.3A; Core Material: Ferrite; DC Resistance (DCR): 100mR; Test Frequency: 1MHz; Self Resonant Frequency: 40MHz; Shielding: Shielded; Depth: 2.2mm; Length: 2.5mm; Max DC Current: 1.3A; Military Standard: Not; Current Rating: 1.3A; Termination: SMD/SMT; Radiation Hardening: No; Tolerance: 20%; Height: 1.2mm; Case Code (Metric): 2520; DC Current: 1.3A; Inductance Tolerance: 20%; Packaging: Tape and Reel; Width: 2mm; REACH SVHC: No SVHC; Mount: Surface Mount; Max Operating Temperature: 125°C; Lead Free: Lead Free; Case/Package: 1008; Case Code (Imperial): 1008; Series: LQM2HP_G0; Height - Seated (Max): 0.039inch; Package Quantity: 3000; Min Operating Temperature: -55°C
C?#1 = CMP-2000-05393-2: Multilayer Ceramic Capacitors 100nF ±10% 50V X7R SMD 0402; Voltage: 50V; Dielectric Material: Ceramic; Min Operating Temperature: -55°C; Depth: 0.5mm; Radiation Hardening: No; RoHS Compliant: Yes; Lead Free: Lead Free; Resistor Type: Ceramic; Height: 0.5mm; Dielectric: X7R; Thickness: 0.022inch; Case/Package: 0402; Case Code (Metric): 1005; Termination: SMD/SMT; Packaging: Tape and Reel; Max Operating Temperature: 125°C; Mount: Surface Mount; Package Quantity: 1; Width: 0.02inch; Weight: 2.3E-05oz; Voltage Rating: 50V; Tolerance: 10%; Construction: Flat; Case Code (Imperial): 0402; Length: 1mm; REACH SVHC: No SVHC; Series: C
C?#2 = CMP-2000-04980-2: Multilayer Ceramic Capacitors 10μF ±20% 10V X5R SMD 0603; Min Operating Temperature: -55°C; RoHS Compliant: Yes; Package Quantity: 1; Max Operating Temperature: 85°C; Radiation Hardening: No; Packaging: Tape and Reel; REACH SVHC: No SVHC; Length: 1.6mm; Case/Package: 0603; Series: C; Thickness: 0.035inch; Weight: 7.1E-05oz; Dielectric: X5R; Termination: SMD/SMT; Dielectric Material: Ceramic; Mount: Surface Mount; Construction: Flat; Resistor Type: Ceramic; Tolerance: 20%; Case Code (Metric): 1608; Number of Pins: 2; Case Code (Imperial): 0603; Depth: 0.8mm; Lead Free: Lead Free; Width: 0.031inch; Height: 0.8mm; Voltage Rating (DC): 10V
C?#3 = CMP-2008-04588-2: Chip Multilayer Ceramic Capacitors for General Purpose, 0402, 1.0uF, X7R, 15%, 20%, 6.3V; Width: 0.02inch; REACH SVHC: No SVHC; Mount: Surface Mount; Case Code (Imperial): 0402; Thickness: 0.022inch; Height: 0.5mm; Termination: SMD/SMT; Tolerance: 20%; Packaging: Tape and Reel; Package Quantity: 10000; Weight: 0.000212oz; Case Code (Metric): 1005; Dielectric: X7R; Min Operating Temperature: -55°C; Length: 0.039inch; Voltage Rating (DC): 6.3V; Case/Package: 0402; Max Operating Temperature: 125°C
C?#4 = CMP-2008-03953-1: Manufacturer: Murata; Part Number: GRM155R70J103KA01D
C?#5-C?#7 = CMP-2000-05441-1: Chip Capacitor, 22 uF, +/- 20%, 10 V, -55 to 85 degC, 0603 (1608 Metric), RoHS, Tape and Reel; Manufacturer: TDK; PCN Part Number: MLCCPartNumberChange30/Nov/2012; Product Training Modules: CSeriesGeneralApplicationsSEAT,CCV,andTVCLDesignToolsGuidetoReplacinganElectrolyticCapacitorwithanMLCC; Other Names: 445-9077-1; Design Resources: 20WNon-IsolatedBuckLEDDriverUsingPLLNK460KG; Online Catalog: CSeries,GeneralPurpose; Temperature Coefficient: X5R; Kits: 445-9014-KIT-ND-KITMLCC100PF-22UF060310-50V; Packaging: CutTape(CT); Standard Package: 1; Package / Case: 0603(1608Metric); Lead Style: -; Features: -; Ratings: -; Operating Temperature: -55degC~85degC; Applications: GeneralPurpose; Package Reference: 603; Datasheet URL: http://download.siliconexpert.com/pdfs/2015/4/21/15/54/45/779/tdk_/manual/37024850441143360mlcc_commercial_general_en.pdf; Datasheet Version: Mar-15; Mounting Type: SurfaceMount,MLCC; Lead Spacing: -; Size / Dimension: 0.063"Lx0.031"W(1.60mmx0.80mm); Height - Seated (Max): -; Package Description: 2-Pin Surface Mount Device, Body 1.6 x 0.8 mm; Manufacturer URL: http://www.tdk.com/; RoHS Information: RoHSCertificate-MLCC; Tolerance: ±20%; Series: C; Thickness (Max): 0.035"(0.90mm); Family: CeramicCapacitors; Category: Capacitors
C?#8 C?#29 C?#31-C?#59 = CMP-2100-03641-2: CAP CER 0.1UF 16V X7R 0402; Manufacturer: Murata; Standoff Height: 0mm; Tolerance: 10%; Material: Ceramic; RoHS: TRUE; Manufacturer Part Number: GRM155R71C104KA88D; Temperature Characteristic: X7R; Octopart: https://octopart.com/grm155r71c104ka88d-murata-196880; Digikey Description: CAP CER 0.1UF 16V X7R 0402; Device Class L3: Ceramic Capacitors; Height: 0.55mm; ComponentLink2Description: Datasheet; Temperature Range Low: -55°C; Ipc Land Pattern Name: CAPC10050X219; ComponentLink2URL: https://search.murata.co.jp/Ceramy/image/img/A01X/G101/ENG/GRM155R71H471KA01-01A.pdf; Device Class L1: Passive Components; Lead Free: yes; Category: Cap; Package: GRM15; Temperature: -55°C to +125°C; Device Class L2: Capacitors; Capacitance: 0.10μF; Temperature Range High: +125°C; Mouser Description: 0402 0.1 uF 16V ±10 % Tolerance X7R SMT Multilayer Ceramic Capacitor
C?#9 C?#10 = CMP-06035-047309-1: Cap Ceramic 4.7uF 25V X7R 10% Pad SMD 1206 Soft Termination  +125°C Automotive T/R; Max Operating Temperature: 125°C; Mount: Surface Mount; Features: Soft Termination; Thickness: 0.075inch; Dielectric: X7R; Tolerance: 10%; Termination: SMD/SMT; Ratings: AEC-Q200; Length: 0.126inch; Case Code (Imperial): 1206; Lead Free: Lead Free; Case Code (Metric): 3216; Package Quantity: 2000; Min Operating Temperature: -55°C; Case/Package: 1206; Width: 0.063inch; Packaging: Tape and Reel; Depth: 1.6mm
  C?#9: Voltage Rating: 25V
  C?#10: Voltage Rating (DC): 25V
C?#11 = CMP-2006-03280-2: CAP CER 0.082UF 25V 10% X7R 0603; Manufacturer: KEMET; Automotive Grade: Grade 1; Value: 82,000 pF; Material: Ceramic; Tolerance: 0.1; Temperature Coefficient: 30ppm/°C; Digikey Description: CAP CER 0.082UF 25V 10% X7R 0603; Category: Cap; Device Class L2: Capacitors; Mouser Description: Multilayer Ceramic Capacitors MLCC - SMD/SMT 25volts 82000pF X7R 10%; Device Class L3: Ceramic Capacitors; Octopart: https://octopart.com/c0603c823k3ractu-kemet-9142851; ComponentLink2URL: https://api.kemet.com/component-edge/download/datasheet/C0603C100J5GACAUTO.pdf; Package: C0603C-CF; Temperature Characteristic: X7R; ComponentLink2Description: Datasheet; Lead Free: Yes; Automotive: Yes; Manufacturer Part Number: C0603C823K3RACTU; Temperature Range Low: -55°C; Temperature Range High: +125°C; Height: 0.87mm; RoHS: TRUE; Device Class L1: Passive Components; Temperature: -55°C to +125°C
C?#12 = CMP-2006-02226-2: Cap Ceramic 2200pF 50V X7R 10% Pad SMD 0603 Soft Termination +125°C Automotive T/R; Voltage Rating (DC): 50V; Thickness: 0.031inch; Case/Package: 0603; Termination: SMD/SMT; Features: Soft Termination; Dielectric: X7R; Packaging: Tape and Reel; Mount: Surface Mount; Height: 0.8mm; Tolerance: 10%; Case Code (Metric): 1608; Case Code (Imperial): 0603; Package Quantity: 1; Depth: 0.8mm; Length: 1.6mm; Width: 0.031inch; Radiation Hardening: No; Max Operating Temperature: 125°C; Min Operating Temperature: -55°C; Ratings: AEC-Q200; Lead Free: Lead Free
C?#13 C?#14 = CMP-06035-058931-1: Cap Ceramic 0.1uF 25V X7R 10% Pad SMD 0603 Soft Termination +125°C Automotive T/R; Tolerance: 10%; Mount: Surface Mount; Features: Soft Termination; Case Code (Imperial): 0603; Min Operating Temperature: -55°C; Case/Package: 0603; Max Operating Temperature: 125°C; Case Code (Metric): 1608; Ratings: AEC-Q200; Packaging: Tape and Reel
C?#15 C?#16 = CMP-13271-000724-1: Cap Ceramic 10nF 25V X7R ±10% Pad SMD 0603 +125°C T/R; Mount: Surface Mount; Case/Package: 0603; Tolerance: 10%; Thickness: 0.035inch; Features: Soft Termination; Max Operating Temperature: 125°C; Case Code (Metric): 1608; Width: 0.031inch; Case Code (Imperial): 0603; Min Operating Temperature: -55°C; Packaging: Tape and Reel; Length: 0.063inch; Ratings: AEC-Q200
C?#17 = CMP-06035-058931-1: Cap Ceramic 0.1uF 25V X7R 10% Pad SMD 0603 Soft Termination +125°C Automotive T/R; Capacitance: 100nF; Tolerance: 10%; Mount: Surface Mount; Features: Soft Termination; Case Code (Imperial): 0603; Min Operating Temperature: -55°C; Case/Package: 0603; Max Operating Temperature: 125°C; Case Code (Metric): 1608; Ratings: AEC-Q200; Packaging: Tape and Reel
C?#18 = CMP-06035-003589-1: Chip Multilayer Ceramic Capacitors for General Purpose, 1206, 10uF, X7R, 15%, 10%, 25V; Case Code (Imperial): 1206; Voltage Rating (DC): 25V; Voltage Rating: 25V; Length: 3.2mm; Lead Free: Lead Free; Thickness: 0.071inch; Package Quantity: 1; Width: 1.6mm; Max Operating Temperature: 125°C; Number of Pins: 2; Height: 1.6mm; Case Code (Metric): 3216; REACH SVHC: No SVHC; Radiation Hardening: No; Case/Package: 1206; Material: Ceramic; Tolerance: 10%; Mount: Surface Mount; Packaging: Tape and Reel; Dielectric: X7R; Termination: SMD/SMT; Min Operating Temperature: -55°C; Depth: 1.6mm
C?#19 C?#24 = CMP-08246-002551-1: Cap Ceramic 1uF 35V X7R 10% Pad SMD 0603 +125°C Automotive T/R; Termination: SMD/SMT; Packaging: Tape and Reel; Capacitance: 1uF; Tolerance: 10%; Mount: Surface Mount; Thickness: 0.035inch; Case Code (Imperial): 0603; Voltage Rating: 35V; Case/Package: 0603; Case Code (Metric): 1608; Dielectric: X7R; Width: 0.031inch; Length: 0.063inch; Min Operating Temperature: -55°C; Weight: 7.1E-05oz; Max Operating Temperature: 125°C; Voltage Rating (DC): 35V; Height: 0.8mm; Ratings: AEC-Q200; Package Quantity: 4000
C?#20 = UBT1E331MPD1TD: No Description Available; Mfr_Name: Nichicon
C?#21 C?#27 = CMP-08246-006023-1: Multilayer Ceramic Capacitors 3.3μF ±10% 25V X7R SMD 0805; Capacitance: 3.3uF; Height: 1.25mm; Resistor Type: Ceramic; Width: 0.049inch; Length: 2mm; Series: C; Weight: 0.000194oz; Mount: Surface Mount; Tolerance: 10%; Construction: Flat; Case Code (Imperial): 0805; Voltage Rating (DC): 25V; Package Quantity: 1; Lead Free: Lead Free; Voltage Rating: 25V; RoHS Compliant: Yes; Radiation Hardening: No; Case Code (Metric): 2012; REACH SVHC: No SVHC; Dielectric Material: Ceramic; Depth: 1.25mm; Packaging: Tape and Reel; Min Operating Temperature: -55°C; Thickness: 0.057inch; Max Operating Temperature: 125°C; Termination: SMD/SMT; Dielectric: X7R; Case/Package: 0805
C?#22 C?#26 = CMP-2006-02964-1: Manufacturer: Murata; Part Number: GRM188R72E471KW07D
C?#23 C?#25 = CMP-1035-02648-3: Chip Multilayer Ceramic Capacitors for General Purpose, 0603, 0.22uF, X7R, 15%, 10%, 25V; Voltage: 50V; Number of Pins: 2; Length: 1.6mm; Material: Ceramic; Depth: 0.8mm; REACH SVHC: No SVHC; Voltage Rating (DC): 25V; Tolerance: 10%; Max Operating Temperature: 125°C; Lead Free: Lead Free; Package Quantity: 1; Voltage Rating: 25V; Width: 0.8mm; Case Code (Metric): 1608; Min Operating Temperature: -55°C; Case/Package: 0603; Mount: Surface Mount; Dielectric: X7R; Height: 0.8mm; Termination: SMD/SMT; Radiation Hardening: No; Case Code (Imperial): 0603; Thickness: 0.035inch; Packaging: Tape and Reel
C?#28 = CMP-2007-03345-2: Ceramic Capacitor for Automotive 1uF ±10% 25VDC X7R 0805 Embossed T/R; Voltage Rating (DC): 25V; Packaging: Tape and Reel; Dielectric: X7R; Termination: SMD/SMT; Mount: Surface Mount; Package Quantity: 10000; Tolerance: 10%; Thickness: 0.055inch; Width: 0.049inch; Case/Package: 0805; Construction: Flat; Height: 1.25mm; Case Code (Imperial): 0805; Radiation Hardening: No; Series: GCM; Max Operating Temperature: 125°C; Case Code (Metric): 2012; Voltage Rating: 25V; Length: 2mm; Depth: 1.25mm; Capacitance: 1uF; Ratings: AEC-Q200; Min Operating Temperature: -55°C
C?#30 = CMP-2006-02836-2: Chip Multilayer Ceramic Capacitors for General Purpose, 0603, 2.2uF, X7R, 15%, 10%, 10V; Case Code (Metric): 1608; Height: 0.8mm; Packaging: Cut Tape; Voltage: 10V; Lead Free: Lead Free; Min Operating Temperature: -55°C; Voltage Rating (DC): 10V; Max Operating Temperature: 125°C; Voltage Rating: 10V; Dielectric: X7R; Depth: 0.8mm; Case Code (Imperial): 0603; Termination: SMD/SMT; Case/Package: 0603; Number of Pins: 2; REACH SVHC: No SVHC; Mount: Surface Mount; Width: 0.031inch; Material: Ceramic; Capacitance: 2.2uF; Package Quantity: 1; Weight: 7.1E-05oz; Length: 1.6mm; Thickness: 0.035inch; Tolerance: 10%
C?#60 = CMP-2008-04204-1: Manufacturer: Murata; Part Number: GRM1555C1E471JA01D
D?#1 = CMP-22017-000007-1: LED GREEN CLEAR CHIP SMD; Luminous Intensity: 12mcd; Lens Color: Colorless; Dominant Wavelength: 569nm; Number of LEDs: 1; Power Dissipation: 100mW; Viewing Angle: 130°; Reverse Voltage: 5V; Test Current: 10mA; Forward Voltage: 2.1V; Wavelength: 585nm; Lens Style: Diffused; Forward Current: 30mA; Height: 0.8mm; Mount: Surface Mount; Package Quantity: 1; Length: 2mm; Case Code (Metric): 2012; Number of Pins: 2; Number of Elements: 1; Packaging: Tape and Reel; Color: Green; Min Operating Temperature: -55°C; Case/Package: 0805; Power Rating: 100mW; Max Operating Temperature: 85°C; Radiation Hardening: No; Depth: 1.25mm; Lens Transparency: Clear; Width: 1.25mm; Lead Free: Lead Free; Case Code (Imperial): 0805; Illumination Color: Green
D?#2 = CMP-1426-00003-3: NexarPartId: 29717775; Luminous Intensity: 145mcd; Test Current: 20mA; Max Junction Temperature (Tj): 95°C; Max Reverse Voltage (DC): 5V; Dominant Wavelength: 470nm; Power Dissipation: 105mW; Peak Wavelength: 465nm; Forward Voltage: 3.2V; Viewing Angle: 140°; Color: Blue; Forward Current: 100mA; Lens Style: Clear, Rectangular; Mount: Surface Mount; Packaging: Tape and Reel; Min Operating Temperature: -40°C; Length: 1.6mm; Max Operating Temperature: 85°C; Width: 800µm; REACH SVHC: Unknown; Height: 700µm; Case Code (Imperial): 0603; RoHS: Compliant; Case/Package: 0603; Case Code (Metric): 1608; Wavelength: 470nm; Reverse Voltage: 5V
FB? = CMP-2000-05401-2: Manufacturer Lifecycle Status: PRODUCTION; NexarPartId: 12090955; RMS Current (Irms): 2A; Test Frequency: 100MHz; Tolerance: 25%; Core Material: Ferrite; Series Resistance: 100mΩ; Impedance: 600Ω; Packaging: Digi-Reel®; Length: 2mm; Min Operating Temperature: -55°C; Width: 1.25mm; Max Width: 1.45mm; Lead Free: Lead Free; Current Rating: 2A; Case Code (Imperial): 0805; Min Length: 1.8mm; Schedule B: 8504500000, 8504500000; REACH SVHC: No SVHC; Case Code (Metric): 2012; Max DC Current: 2A; Case/Package: 0805; Lifecycle Status: Production; Min Width: 1.05mm; Mount: Surface Mount; Height: 1.0414mm; Resistance: 100mΩ; DC Resistance (DCR): 100mΩ; Max Operating Temperature: 125°C; Max Length: 2.2mm; RoHS: Compliant
J?#1 = ED555/7DS: CONN TERMINAL BLOCK 3.5MM 7POS PCB; Manufacturer: On Shore Technology Inc.; Capacitance: SKIP; Is Female: yes; Library Path1: parts/Conn_On_Shore_Technology_Inc._ED555-7DS_eec.SchLib; Value: SKIP; Voltage: 150V; Part Number: ED555/7DS; Datasheet Path: datasheets/Conn_On_Shore_Technology_Inc._ED555-7DS_eec.pdf; ComponentLink1Description: Upverter; ComponentLink1URL: https://upverter.com/upn/revision/a9b0f9fa33d156d4/; ComponentLink2Description: Datasheet; ComponentLink2URL: https://upverter.com/datasheet/8c9b76d641599975df6fb94c66cbfc419a2e9291.pdf; Datasheet Path1: datasheets/Conn_On_Shore_Technology_Inc._ED555-7DS_eec.pdf; Digikey Description: CONN TERMINAL BLOCK 3.5MM 7POS PCB; Digikey Part Number: ED1519-ND; Inductance: SKIP; Lead Free: yes; Library Ref1: ED555-7DS; Package: HDR7; Price: 1.5222723186; Resistance: SKIP; RoHS: TRUE; Supplier 1: Digi-Key; Supplier 2: Mouser; Supplier Part Number 1: ED1519-ND; Temperature: -30°C to +105°C; Temperature Range High: +105°C; Temperature Range Low: -30°C; helpURL: https://upverter.com/upn/revision/a9b0f9fa33d156d4/
J?#2 = DX4R205JJAR1800: No Description Available; Mfr_Name: JAE Electronics; Type: USB, DVI, HDMI, Connectors; RefDes: RefDes
J?#3 = LPPB061NGCN-RC: No Description Available; Mfr_Name: Sullins; RefDes: RefDes; Type: Type
L?#1 = Inductor: Code_IEC: 1005; Published: 8-Jun-2000; LatestRevisionDate: 29-May-2009; LatestRevisionNote: IPC-7351 Footprint Added.; PackageReference: 0402-A; Publisher: Altium Limited; PackageDescription: Chip Inductor; Code_JEITA: 0402
L?#2 = MSD1278T-223MLD: No Description Available; Mfr_Name: Coilcraft; Type: Coupled Inductors
LED? = LTST-C190CKT: No Description Available; Mfr_Name: LITE-ON
R?#1 = CMP-26527-002390-1: 33.2Ω ±1% 0.05W 0201 Thick Film Chip Resistor AEC-Q200 compliant; Temperature Coefficient: 200ppm/°C; Resistance: 33.2R; Max Power Dissipation: 50mW; Case/Package: 0201; Mount: Surface Mount; RoHS Compliant: Yes; Height: 0.009inch; Number of Terminations: 2; Case Code (Metric): 0603; Tolerance: 1%; Max Operating Temperature: 125°C; Packaging: Tape and Reel; Width: 0.012inch; Contact Plating: Tin; Case Code (Imperial): 0201; Series: RMCF; Size Code: 0201; Resistor Type: Thick Film; Length: 0.024inch; Lead Free: Lead Free; Power Rating: 50mW; Min Operating Temperature: -55°C; Radiation Hardening: No
R?#2 = CMP-2004-00003-1: Manufacturer: Vishay; Part Number: CRCW0201100KFNED
R?#3 = CMP-2000-04110-1: Manufacturer: Yageo; Part Number: RC0603FR-0766K5L
R?#4 = CMP-2004-02624-1: Manufacturer: Panasonic; Part Number: ERJ-1GE0R00C
R?#5 = CMP-2100-03662-2: RES SMD 100K OHM 1% 1/10W 0603; Voltage Rating (DC): 50V; Max Power Dissipation: 100mW; Temperature Coefficient: 100ppm/°C; Working Voltage: 75V; Length: 1.6mm; Lead Free: Lead Free; Number of Terminations: 2; Packaging: Tape and Reel; Voltage Rating: 50V; Termination: SMD/SMT; Width: 0.8mm; Resistor Type: Thick Film; Resistance Tolerance: 1%; Features: Moisture Resistant; Height: 0.45mm; Construction: Rectangular; Case/Package: 0603; Military Standard: Not; Case Code (Imperial): 0603; Series: RC; Technology: THICK FILM; Depth: 0.8mm; RoHS Compliant: Yes; REACH SVHC: No SVHC; Min Operating Temperature: -55°C; Case Code (Metric): 1608; Max Operating Temperature: 155°C; Power Rating: 100mW; Number of Pins: 2; Tolerance: 1%
R?#6 = CMP-1012-00248-1: 4R75 0.1W 1% 0603 (1608 Metric)  SMD; Value: 4.75 Ohm; Case-Metric: 1608; Case-EIA: 0603; Tolerance: 1 %; Technology: SMT; Power: 0.1 W
R?#7 = CMP-2000-03390-2: RES Thick Film, 499Ω, 1%, 0.1W, 100ppm/°C, 0603; Voltage Rating (DC): 75V; Power Rating: 100mW; Case/Package: 0603; Package Quantity: 5000; Military Standard: Not; Length: 1.55mm; Width: 0.85mm; Number of Terminations: 2; Lead Free: Lead Free; Height: 0.45mm; Weight: 7.1E-05oz; Composition: Thick Film; Radiation Hardening: No; Max Operating Temperature: 155°C; Tolerance: 1%; Working Voltage: 75V; Temperature Coefficient: 100ppm/°C; Packaging: Tape and Reel; Contact Plating: Tin; Termination: SMD/SMT; Depth: 0.85mm; Case Code (Metric): 1608; Min Operating Temperature: -55°C; Mount: Surface Mount; Case Code (Imperial): 0603; Voltage Rating: 75V
R?#8 R?#10 = CMP-1011-00001-2: Manufacturer: Yageo / Phycomp; Part Number: RC0402JR-070RL
R?#9 = CMP-2002-07472-3: RES 1K OHM 1% 1/16W 0402; Max Power Dissipation: 63mW; Resistance: 1kR; Voltage Rating (DC): 50V; Temperature Coefficient: 100ppm/°C; Power Rating: 62.5mW; Technology: THICK FILM; Size Code: 0402; Series: RC; Length: 1mm; Case/Package: 0402; Features: Moisture Resistant; Termination: SMD/SMT; Case Code (Metric): 1005; Reach SVHC Compliant: Yes; Number of Terminations: 2; Tolerance: 1%; Lead Free: Lead Free; Military Standard: Not; Resistor Type: Thick Film; Max Operating Temperature: 155°C; RoHS Compliant: Yes; Construction: Rectangular; Voltage Rating: 50V; Packaging: Tape and Reel; Height: 0.32mm; Number of Pins: 2; Resistance Tolerance: 1%; Case Code (Imperial): 0402; Depth: 0.5mm; Min Operating Temperature: -55°C; Width: 0.5mm
R?#11-R?#14 R?#27 = CMP-2002-07701-1: Manufacturer: Yageo / Phycomp; Part Number: RC0402FR-0747KL
R?#15 R?#20 = CMP-2001-03952-2: RES Thick Film, 49.9kΩ, 1%, 0.125W, 100ppm/°C, 0805; Resistance: 49.9kR; Power Rating: 125mW; Voltage Rating (DC): 150V; Contact Plating: Tin; Case Code (Imperial): 0805; Package Quantity: 10; Termination: SMD/SMT; Length: 2mm; Width: 0.049inch; Case Code (Metric): 2012; Temperature Coefficient: 100ppm/°C; Tolerance: 1%; Depth: 1.25mm; Mount: Surface Mount; Lead Free: Lead Free; Min Operating Temperature: -55°C; Case/Package: 0805; Number of Terminations: 2; Composition: Thick Film; Height: 0.45mm; Voltage Rating: 150V; Max Power Dissipation: 125mW; Features: Automotive AEC-Q200; Military Standard: Not; Radiation Hardening: No; Max Operating Temperature: 155°C; Weight: 0.000194oz; Packaging: Tape and Reel
R?#16 R?#26 = CMP-2000-07588-1: Chip Resistor, 10 KOhm, +/- 1%, 0.1 W, -55 to 155 degC, 0402 (1005 Metric), RoHS, Tape and Reel; Manufacturer: Panasonic; Power Rating: 100mW; Voltage Rating: 50V; Resistance: 10KOhm; Case\/Package: 0402; Temperature Coefficient: 100ppm\/degreesC; RoHSCompliant: True; Lead Free: LeadFree; Package Quantity: 1; Contact Plating: Tin; Length: 1mm; Radiation Hardening: No; REACH SVHC: NoSVHC; Max Operating Temperature: 155degC; Depth: 0.5mm; Case Code (Imperial): 0402; Military Standard: Not; Package Description: 2-Pin Surface Mount Device, Body 1 x 0.5 mm; Termination: SMD/SMT; Case Code (Metric): 1005; Height: 0.35mm; Packaging: TapeandReel; Voltage Rating (DC): 50V; Package Reference: 402; Number of Pins: 2; Tolerance: 1%; Mounting Technology: SurfaceMount; Width: 0.02inch; Mount: SurfaceMount; Datasheet URL: https://industrial.panasonic.com/cdbs/www-data/pdf/RDA0000/AOA0000C304.pdf; Composition: ThickFilm; Datasheet Version: 02/2017; Manufacturer URL: http://www.panasonic.com/; Max Power Dissipation: 100mW; Number of Terminations: 2; Min Operating Temperature: -55degC
R?#17 R?#21 = CMP-2001-04039-1: Manufacturer: Vishay Dale; Part Number: CRCW08055R60JNEA
R?#18 R?#19 R?#23 R?#25 = CMP-2000-06942-1: Chip Resistor, 4.7 KOhm, +/- 1%, 0.1 W, -55 to 155 degC, 0603 (1608 Metric), RoHS, Tape and Reel; Manufacturer: Yageo; Power Rating: 100mW; Temperature Coefficient: 100PPM/C; Resistance: 4.7kOhms; Voltage Rating: 50V; Package Reference: 0603; Series: RC; Datasheet Version: Rev. 7, 05/2017; Packaging: Reel; Termination Style: SMD/SMT; Datasheet URL: http://www.yageo.com/documents/recent/PYu-RC_Group_51_RoHS_L_7.pdf; Manufacturer URL: http://www.yageo.com/; Package Description: 2-Pin Surface Mount Device, Body 1.6 x 0.8 mm; Case Code - mm: 1608; Case Code - in: 0603; Mounting Technology: SurfaceMount; Operating Temperature Range: -55Cto+155C; Tolerance: 1%; Product: ThickFilmResistorsGeneralPurpose
R?#22 = RC0603FR-07680RL: No Description Available; Mfr_Name: Yageo
R?#24 = CMP-2000-03390-2: RES Thick Film, 499Ω, 1%, 0.1W, 100ppm/°C, 0603; Voltage Rating (DC): 75V; Power Rating: 100mW; Resistance: 499R; Case/Package: 0603; Package Quantity: 5000; Military Standard: Not; Length: 1.55mm; Width: 0.85mm; Number of Terminations: 2; Lead Free: Lead Free; Height: 0.45mm; Weight: 7.1E-05oz; Composition: Thick Film; Radiation Hardening: No; Max Operating Temperature: 155°C; Tolerance: 1%; Working Voltage: 75V; Temperature Coefficient: 100ppm/°C; Packaging: Tape and Reel; Contact Plating: Tin; Termination: SMD/SMT; Depth: 0.85mm; Case Code (Metric): 1608; Min Operating Temperature: -55°C; Mount: Surface Mount; Case Code (Imperial): 0603; Voltage Rating: 75V
R?#28 R?#29 R?#31 = CMP-2100-03664-2: RES 10K OHM 1% 1/10W 0603; Voltage Rating: 75V; Voltage Rating (DC): 50V; Resistance: 10kR; Power Rating: 100mW; Temperature Coefficient: 100ppm/°C; Depth: 0.8mm; Termination: SMD/SMT; Resistor Type: Thick Film; Series: RC; Construction: Rectangular; Features: Moisture Resistant; Packaging: Tape and Reel; Min Operating Temperature: -55°C; Number of Terminations: 2; Lead Pitch: 0.3mm; RoHS Compliant: Yes; Case/Package: 0603; Resistance Tolerance: 1%; Military Standard: Not; Weight: 7.1E-05oz; Number of Pins: 2; Tolerance: 1%; Length: 1.6mm; Case Code (Imperial): 0603; Lead Free: Lead Free; Width: 0.8mm; Max Power Dissipation: 100mW; Height: 0.45mm; Max Operating Temperature: 155°C; Case Code (Metric): 1608; Size Code: 0603
R?#30 = CMP-2004-02815-1: Manufacturer: Panasonic; Part Number: ERJ-1GEF2552C
R?#32 = CMP-2004-02986-1: Manufacturer: Panasonic; Part Number: ERJ-1GEF5102C
SW?#1 SW?#2 = B12AP: No Description Available; Mfr_Name: NKK Switches; Type: Toggle Switches; RefDes: RefDes
U?#1 = CMP-0859-00760-4: IC TRNSLTR UNIDIRECTIONAL 8X2SON; High Level Output Current: -24mA; Low Level Output Current: 24mA; Max Supply Voltage: 3.6V; Number of Outputs: 2; Min Supply Voltage: 900mV; Turn-On Delay Time: 20ns; Quiescent Current: 6uA; Supply Current: 3.6uA; Output Type: Voltage; Logic Function: Translator; Data Rate: 380Mbps; Max Operating Temperature: 85°C; Lead Free: Lead Free; Mount: Surface Mount; Height: 0.35mm; Min Operating Temperature: -40°C; Radiation Hardening: No; Output Current: 24mA; Width: 1.25mm; Technology: CMOS; Number of Bits: 2; Series: 74AVC; REACH SVHC: No SVHC; Number of Channels: 2; Package Quantity: 3000; RoHS Compliant: Yes; Number of Pins: 8; Length: 1.85mm; Contact Plating: Gold; Nominal Supply Current: 3.6uA; Packaging: Tape and Reel; Number of Inputs: 2; Propagation Delay: 20ns
U?#2 = CDCE913PWR: No Description Available; Mfr_Name: Texas Instruments; RefDes: RefDes; Type: Type
U?#3 = CMP-04918-000009-1: IC REG BUCK ADJ 1A SOT23-5; Manufacturer: Texas Instruments; Number Of Outputs: 1; Max Supply Voltage: 5.5V; Nominal Supply Current: 35uA; Standoff Height: 0mm; Max Junction Temp: +125°C; Output Voltage: 0.6-5.5V; Max Duty Cycle: 100%; Output Type: AdjustableProgrammable; Min Supply Voltage: 2.5V; Switching Frequency: 1.5MHz; Height: 1.45mm; Mouser Description: 1-A High Efficiency Synchronous Buck Converter, SMD, 5-pin SOT-23, T/R 3k; Temperature Range High: +125°C; Manufacturer Part Number: TLV62568DBVR; Switching Topology: Buck; ComponentLink2Description: Datasheet; Digikey Description: IC REG BUCK ADJ 1A SOT23-5; Octopart: https://octopart.com/tlv62568dbvr-texas+instruments-76926199; Category: IC; Device Class L1: Integrated Circuits (ICs); RoHS: TRUE; ComponentLink2URL: http://www.ti.com/lit/ds/symlink/tlv62568.pdf; Lead Free: Yes; Package: DBV0005A; Automotive: No; Device Class L2: Power Management ICs; Temperature: -40°C to +125°C; Temperature Range Low: -40°C; Device Class L3: Voltage Regulators - Switching; Output Current: 1A
U?#4 = CMP-0395-00289-2: Single Output Low Noise LDO, 400 mA, Fixed 1.8 V Output, 1.7 to 5.5 V Input, with Reverse Current Protection, 5-pin SOT-23 (DBV), -40 to 85 degC, Green (RoHS & no Sb/Br); Manufacturer: Texas Instruments; Iout(Max)(A): 0.4; Vdo(Typ)(mV): 75; SubFamily: Single Channel LDO; Fixed Output Options(V): 1.8; Vin(Min)(V): 1.7; Rating: Catalog; Iq(Typ)(mA): 0.3; Accuracy(%): 1; Vin(Max)(V): 5.5; ComponentLink1URL: http://www.ti.com/; ComponentLink4URL: Samples URL:http://www.ti.com/product/tps73618#samples; Mounting Technology: Surface Mount; ComponentLink3Description: Package Specification; ComponentLink1Description: Manufacturer URL; ComponentLink2URL: http://www.ti.com/general/docs/lit/getliterature.tsp?genericPartNumber=TPS73618&fileType=pdf; ComponentLink3URL: http://www.ti.com/litv/pdf/mpds018i; PackageReference: DBV0005A; Vout Adj(Max)(V): 1.8; DatasheetVersion: SBVS038T; Vout Adj(Min)(V): 1.8; PackageVersion: 4073253-4/K; ComponentLink2Description: Datasheet; Code_JEDEC: MO-178; ComponentLink4Description: URL Link1; Eco-Plan: Green (RoHS & no Sb/Br); PartNumber: TPS73618DBVR; PackageDescription: 5-Pin Plastic Small Outline, Body 1.60 Ãƒâ€” 2.90 mm, Pitch 0.95 mm
U?#5 = XEF216-512-TQ128-C20: XCore XEF Microcontroller IC 32-Bit 16-Core 2000MIPS 2MB (2M x 8) FLASH 128-TQFP (14x14); MF: XMOS; Package: TQFP-28 XMOS; Purchase-URL: https://pricing.snapeda.com/search/part/XEF216-512-TQ128-C20/?ref=eda; MP: XEF216-512-TQ128-C20; Price: None; SnapEDA_Link: https://www.snapeda.com/parts/XEF216-512-TQ128-C20/XMOS/view-part/231980/?ref=snap; Check_prices: https://www.snapeda.com/parts/XEF216-512-TQ128-C20/XMOS/view-part/231980/?ref=eda; Value: *; Availability: Warning
U?#6 = TAS5431QPWPRQ1: No Description Available; Mfr_Name: Texas Instruments; TYPE: TYPE; RefDes: RefDes
U?#7-U?#9 = CMP-0859-00915-3: Dual Buffer/Driver with Open-Drain Output, DSF0006A, LARGE T&R; Manufacturer: Texas Instruments; 3-State Output: No; VCC(Min)(V): 1.65; Sub-Family: Inverting Buffer/Driver; tpd @ Nom Voltage(Max)(ns): 8.6,4.4,3.7,2.9; Bits(#): 2; F @ Nom Voltage(Max)(Mhz): 150; Rating: Catalog; Logic: True; VCC(Max)(V): 5.5; Input Type: CMOS/TTL; ICC @ Nom Voltage(Max)(mA): 0.01; Output Type: CMOS; Output Drive (IOL/IOH)(Max)(mA): 32/-32; Technology Family: LVC; Voltage(Nom)(V): 1.8,2.5,3.3,5; Schmitt Trigger: No; DatasheetVersion: SCES308K; Generic Part Number: SN74LVC2G07; Operating Temperature Range(C): -40 to 125; PackageReference: DSF0006A
U?#10 = CMP-0332-00381-2: Single Channel, Ultra Small, Adjustable Supervisory Circuit with Active-High, Open-Drain Output, 1 Supply Monitored, -40 to 125 degC, 6-pin SON (DRY), Green (RoHS & no Sb/Br); Manufacturer: Texas Instruments; Iq(Typ)(uA): 6; Rating: Catalog; VCC(Max)(V): 6.5; VCC(Min)(V): 1.7; Time Delay(ms): 0.04, Programmable; Active High Enable: TRUE; Reset Threshold Accuracy(%): 0.25; SubFamily: Supervisor and Reset IC; # of Supplies Monitored: 1; ComponentLink1Description: Datasheet; Output Driver Type / Reset Output: Active-High, Open-drain; ComponentLink1URL: http://www.ti.com/general/docs/lit/getliterature.tsp?genericPartNumber=TPS3897&fileType=pdf; PartNumber: TPS3897ADRYR; Mounting Technology: Surface Mount; Threshold Voltage 1 (typ)(Typ)(V): Adjustable; PackageReference: DRY0006A; Enable Pin: TRUE; PackageDescription: 6-Pin Plastic Small Outline No-Lead, 1 x 1.45 x 0.6 mm Body, 0.5 mm Pitch; PackageVersion: revF, Dec-2011; DatasheetVersion: SBVS172A
VR? = UA78M33CDCYR: 500-mA, 30-V, linear voltage regulator; MF: Texas Instruments; Purchase-URL: https://pricing.snapeda.com/search/part/UA78M33CDCYR/?ref=eda; Package: SOT-223-4 Texas Instruments; Value: *; Check_prices: https://www.snapeda.com/parts/UA78M33CDCYR/Texas+Instruments/view-part/?ref=eda; SnapEDA_Link: https://www.snapeda.com/parts/UA78M33CDCYR/Texas+Instruments/view-part/?ref=snap; Availability: In Stock; Price: None; MP: UA78M33CDCYR
Y? = ASTMLPE-18-100.000MHZ-LJ-E-T3: Crystal Oscillator 100MHz 1.8V 15pF 4-Pin SMD T/R; Package: None; Price: None; Value: *; MP: ASTMLPE-18-100.000MHZ-LJ-E-T3; Availability: Unavailable